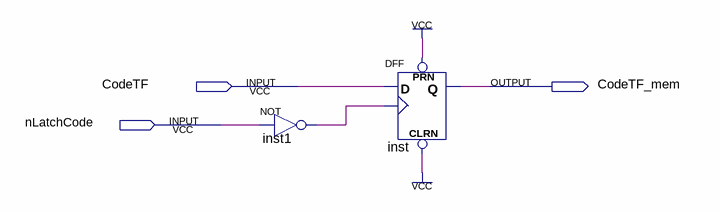
[diagram p0: schematic sheet]
// Quartus schematic MemorisationEtatCode.bdf as structural Verilog: 2 symbols, 3 pins
module MemorisationEtatCode (
  input  CodeTF,
  input  nLatchCode,
  output CodeTF_mem
);

  wire inst1_out;

  not inst1 (inst1_out, nLatchCode);
  DFF inst (.CLRN(1'b1), .CLK(inst1_out), .D(CodeTF), .PRN(1'b1), .Q(CodeTF_mem));
endmodule
